# EAGLE schematic GucciMain (EAGLE 9.1.0)
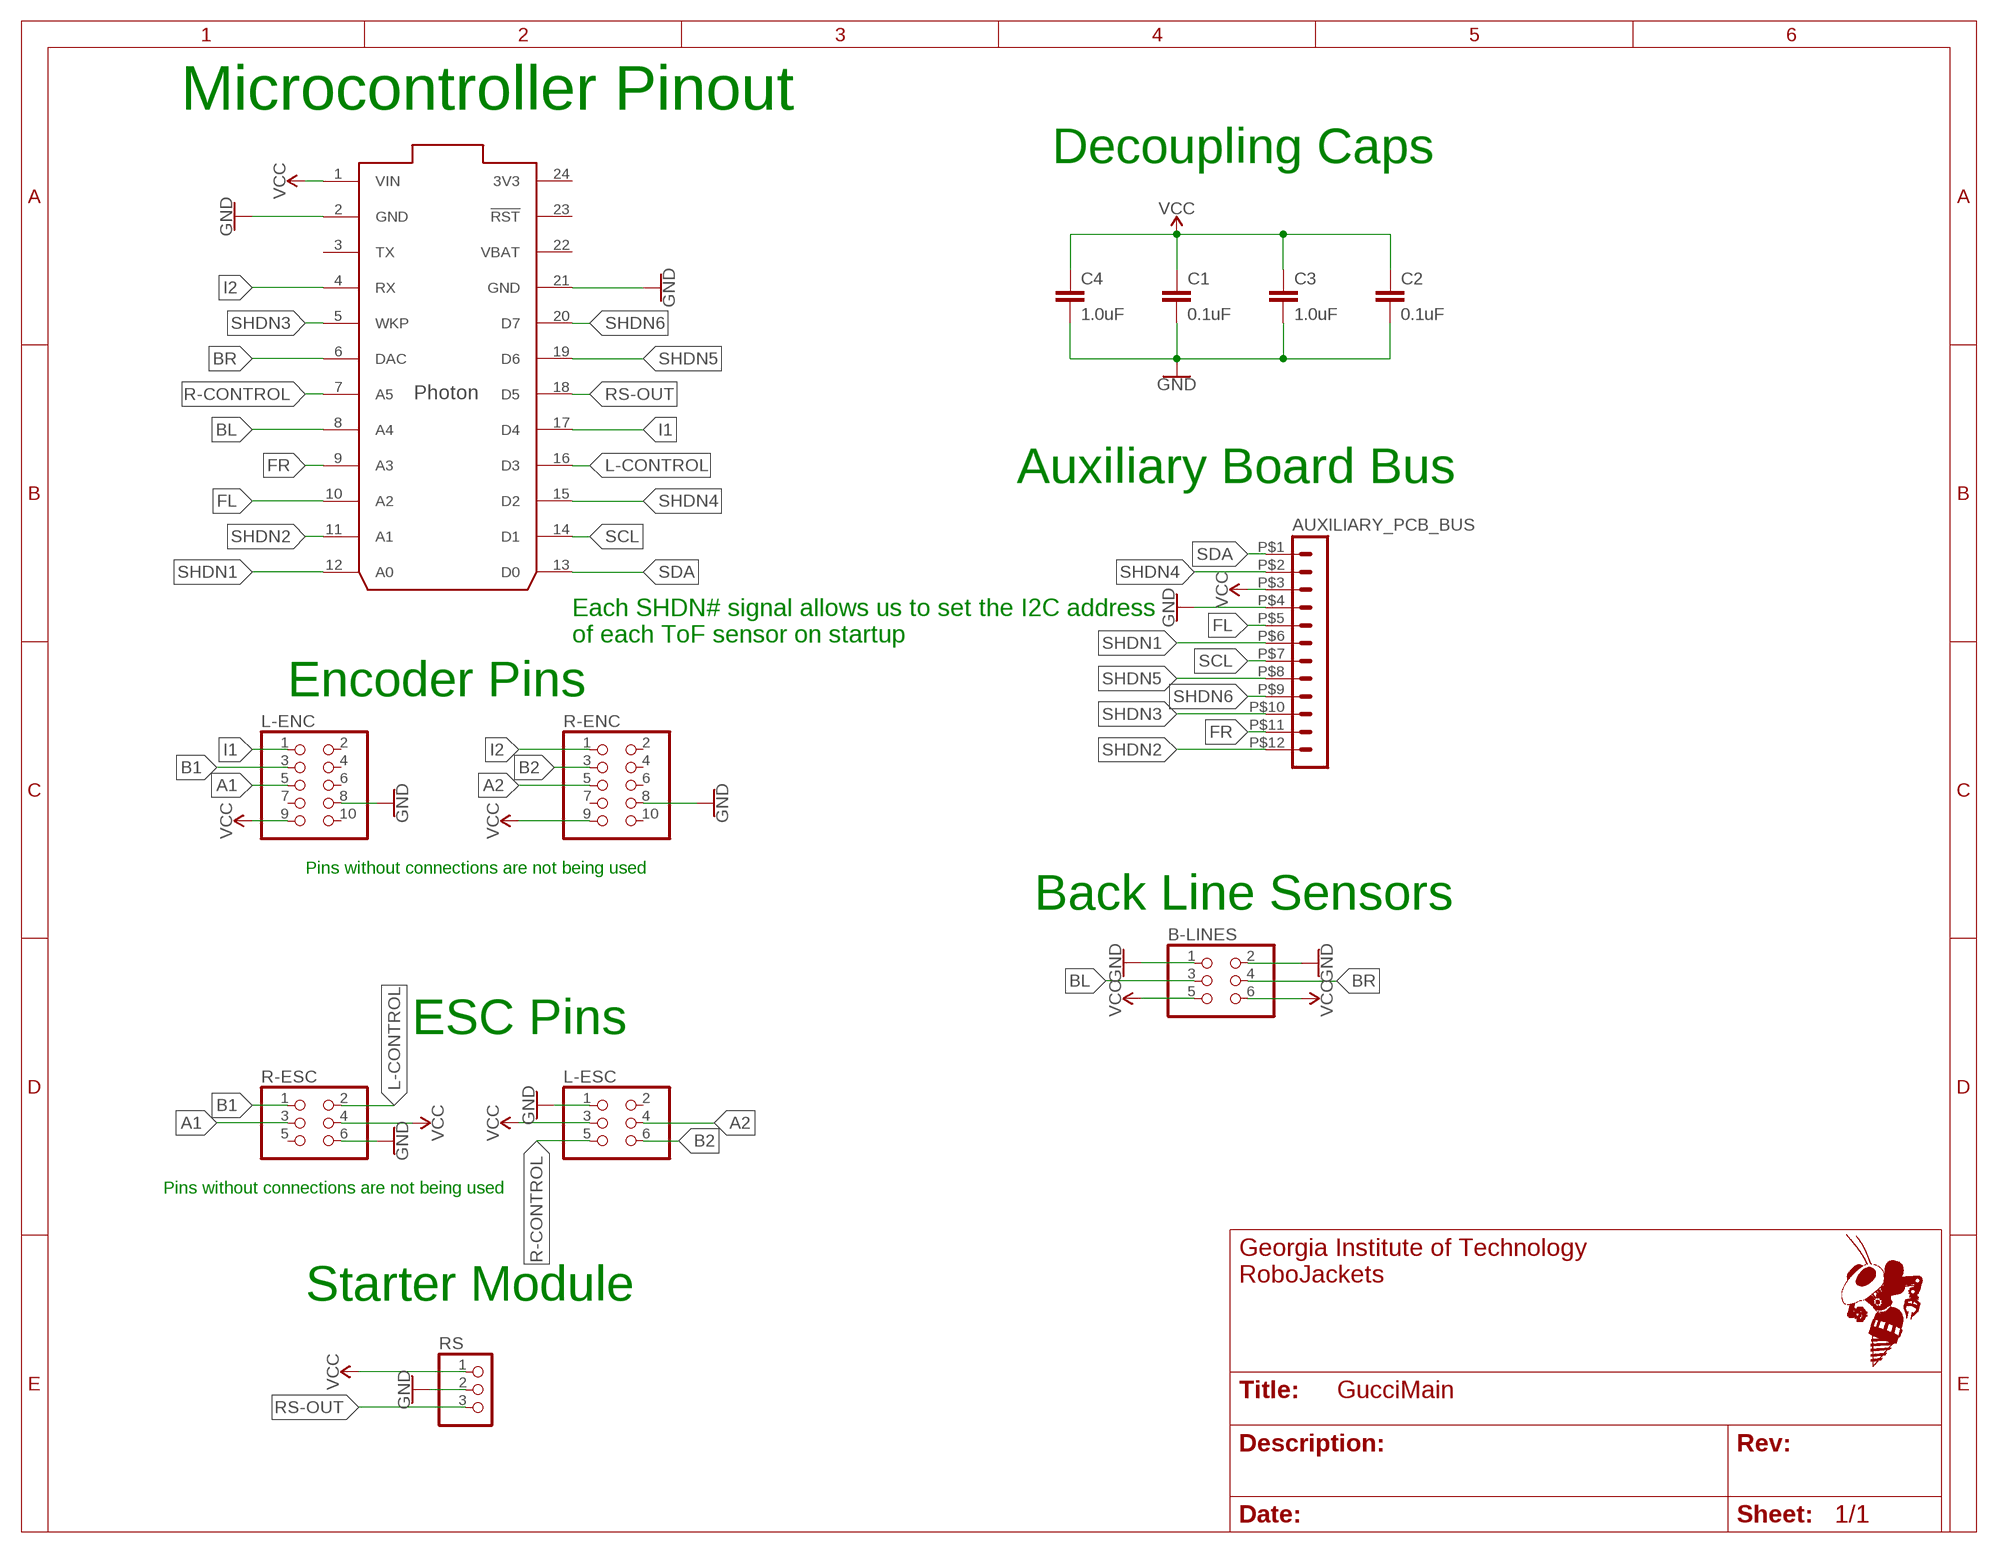
[diagram p0: schematic, sheet 1]

## Parts
AUXILIARY_PCB_BUS  HEADER_POS12_43045-1212  [43045-1212]
B-LINES  PINHD-2X3/90  [2X03/90]
C1  0.1uF  0.1UF-0603-100V-10%  [0603]
C2  0.1uF  0.1UF-0603-100V-10%  [0603]
C3  1.0uF  1.0UF-0603-16V-10%  [0603]
C4  1.0uF  1.0UF-0603-16V-10%  [0603]
L-ENC  PINHD-2X5/90  [2X05/90]
L-ESC  PINHD-2X3  [2X03]
PHOTON  PHOTON  PHOTON_WITH_HEADERS  [PHOTON]
R-ENC  PINHD-2X5/90  [2X05/90]
R-ESC  PINHD-2X3  [2X03]
RS  PINHD-1X3  [1X03]

## Nets
A1: L-ENC.5 R-ESC.3
A2: L-ESC.4 R-ENC.5
B1: L-ENC.3 R-ESC.1
B2: L-ESC.6 R-ENC.3
BL: B-LINES.3 PHOTON.8(A4)
BR: B-LINES.4 PHOTON.6(DAC)
FL: AUXILIARY_PCB_BUS.P$5 PHOTON.10(A2)
FR: AUXILIARY_PCB_BUS.P$11 PHOTON.9(A3)
GND: AUXILIARY_PCB_BUS.P$4 B-LINES.1 B-LINES.2 C1.2 C2.2 C3.2 C4.2 L-ENC.8 L-ESC.1 PHOTON.2(GND) PHOTON.21(GND) R-ENC.8 R-ESC.6 RS.2
I1: L-ENC.1 PHOTON.17(D4)
I2: PHOTON.4(RX) R-ENC.1
L-CONTROL: PHOTON.16(D3) R-ESC.2
R-CONTROL: L-ESC.5 PHOTON.7(A5)
RS-OUT: PHOTON.18(D5) RS.3
SCL: AUXILIARY_PCB_BUS.P$7 PHOTON.14(D1)
SDA: AUXILIARY_PCB_BUS.P$1 PHOTON.13(D0)
SHDN1: AUXILIARY_PCB_BUS.P$6 PHOTON.12(A0)
SHDN2: AUXILIARY_PCB_BUS.P$12 PHOTON.11(A1)
SHDN3: AUXILIARY_PCB_BUS.P$10 PHOTON.5(WKP)
SHDN4: AUXILIARY_PCB_BUS.P$2 PHOTON.15(D2)
SHDN5: AUXILIARY_PCB_BUS.P$8 PHOTON.19(D6)
SHDN6: AUXILIARY_PCB_BUS.P$9 PHOTON.20(D7)
VCC: AUXILIARY_PCB_BUS.P$3 B-LINES.5 B-LINES.6 C1.1 C2.1 C3.1 C4.1 L-ENC.9 L-ESC.3 PHOTON.1(VIN) R-ENC.9 R-ESC.4 RS.1
Unconnected: L-ENC.2 L-ENC.4 L-ENC.6 L-ENC.7 L-ENC.10 L-ESC.2 PHOTON.3(TX) PHOTON.23(!RST) R-ENC.2 R-ENC.4 R-ENC.6 R-ENC.7 R-ENC.10 R-ESC.5

## Notes on the sheet
- Microcontroller Pinout
- Decoupling Caps
- Auxiliary Board Bus
- Each SHDN# signal allows us to set the I2C address
  of each ToF sensor on startup
- Encoder Pins
- Pins without connections are not being used
- Back Line Sensors
- ESC Pins
- Pins without connections are not being used
- Starter Module

## Power pins joined to a net without a drawn wire
3V3: PHOTON.24(3V3)
VBAT: PHOTON.22(VBAT)

## Library data of the parts
AUXILIARY_PCB_BUS = con-molex-micro-fit-3_0:HEADER_POS12_?: Molex - Micro-Fit 3.0 Series connector, 3.00mm (0.118") pitch header, 12 positions.
B-LINES L-ESC R-ESC = pinhead:PINHD-2X3: PIN HEADER
C1 C2 = SparkFun-Capacitors:0.1UF: 0.1µF ceramic capacitors A capacitor is a passive two-terminal electrical component used to store electrical energy temporarily in an electric field.; PROD_ID: CAP-08390
C3 C4 = SparkFun-Capacitors:1.0UF: 1µF ceramic capacitors A capacitor is a passive two-terminal electrical component used to store electrical energy temporarily in an electric field.; PROD_ID: CAP-00868
L-ENC R-ENC = pinhead:PINHD-2X5: PIN HEADER
PHOTON = Particle:PHOTON
RS = pinhead:PINHD-1X3: PIN HEADER